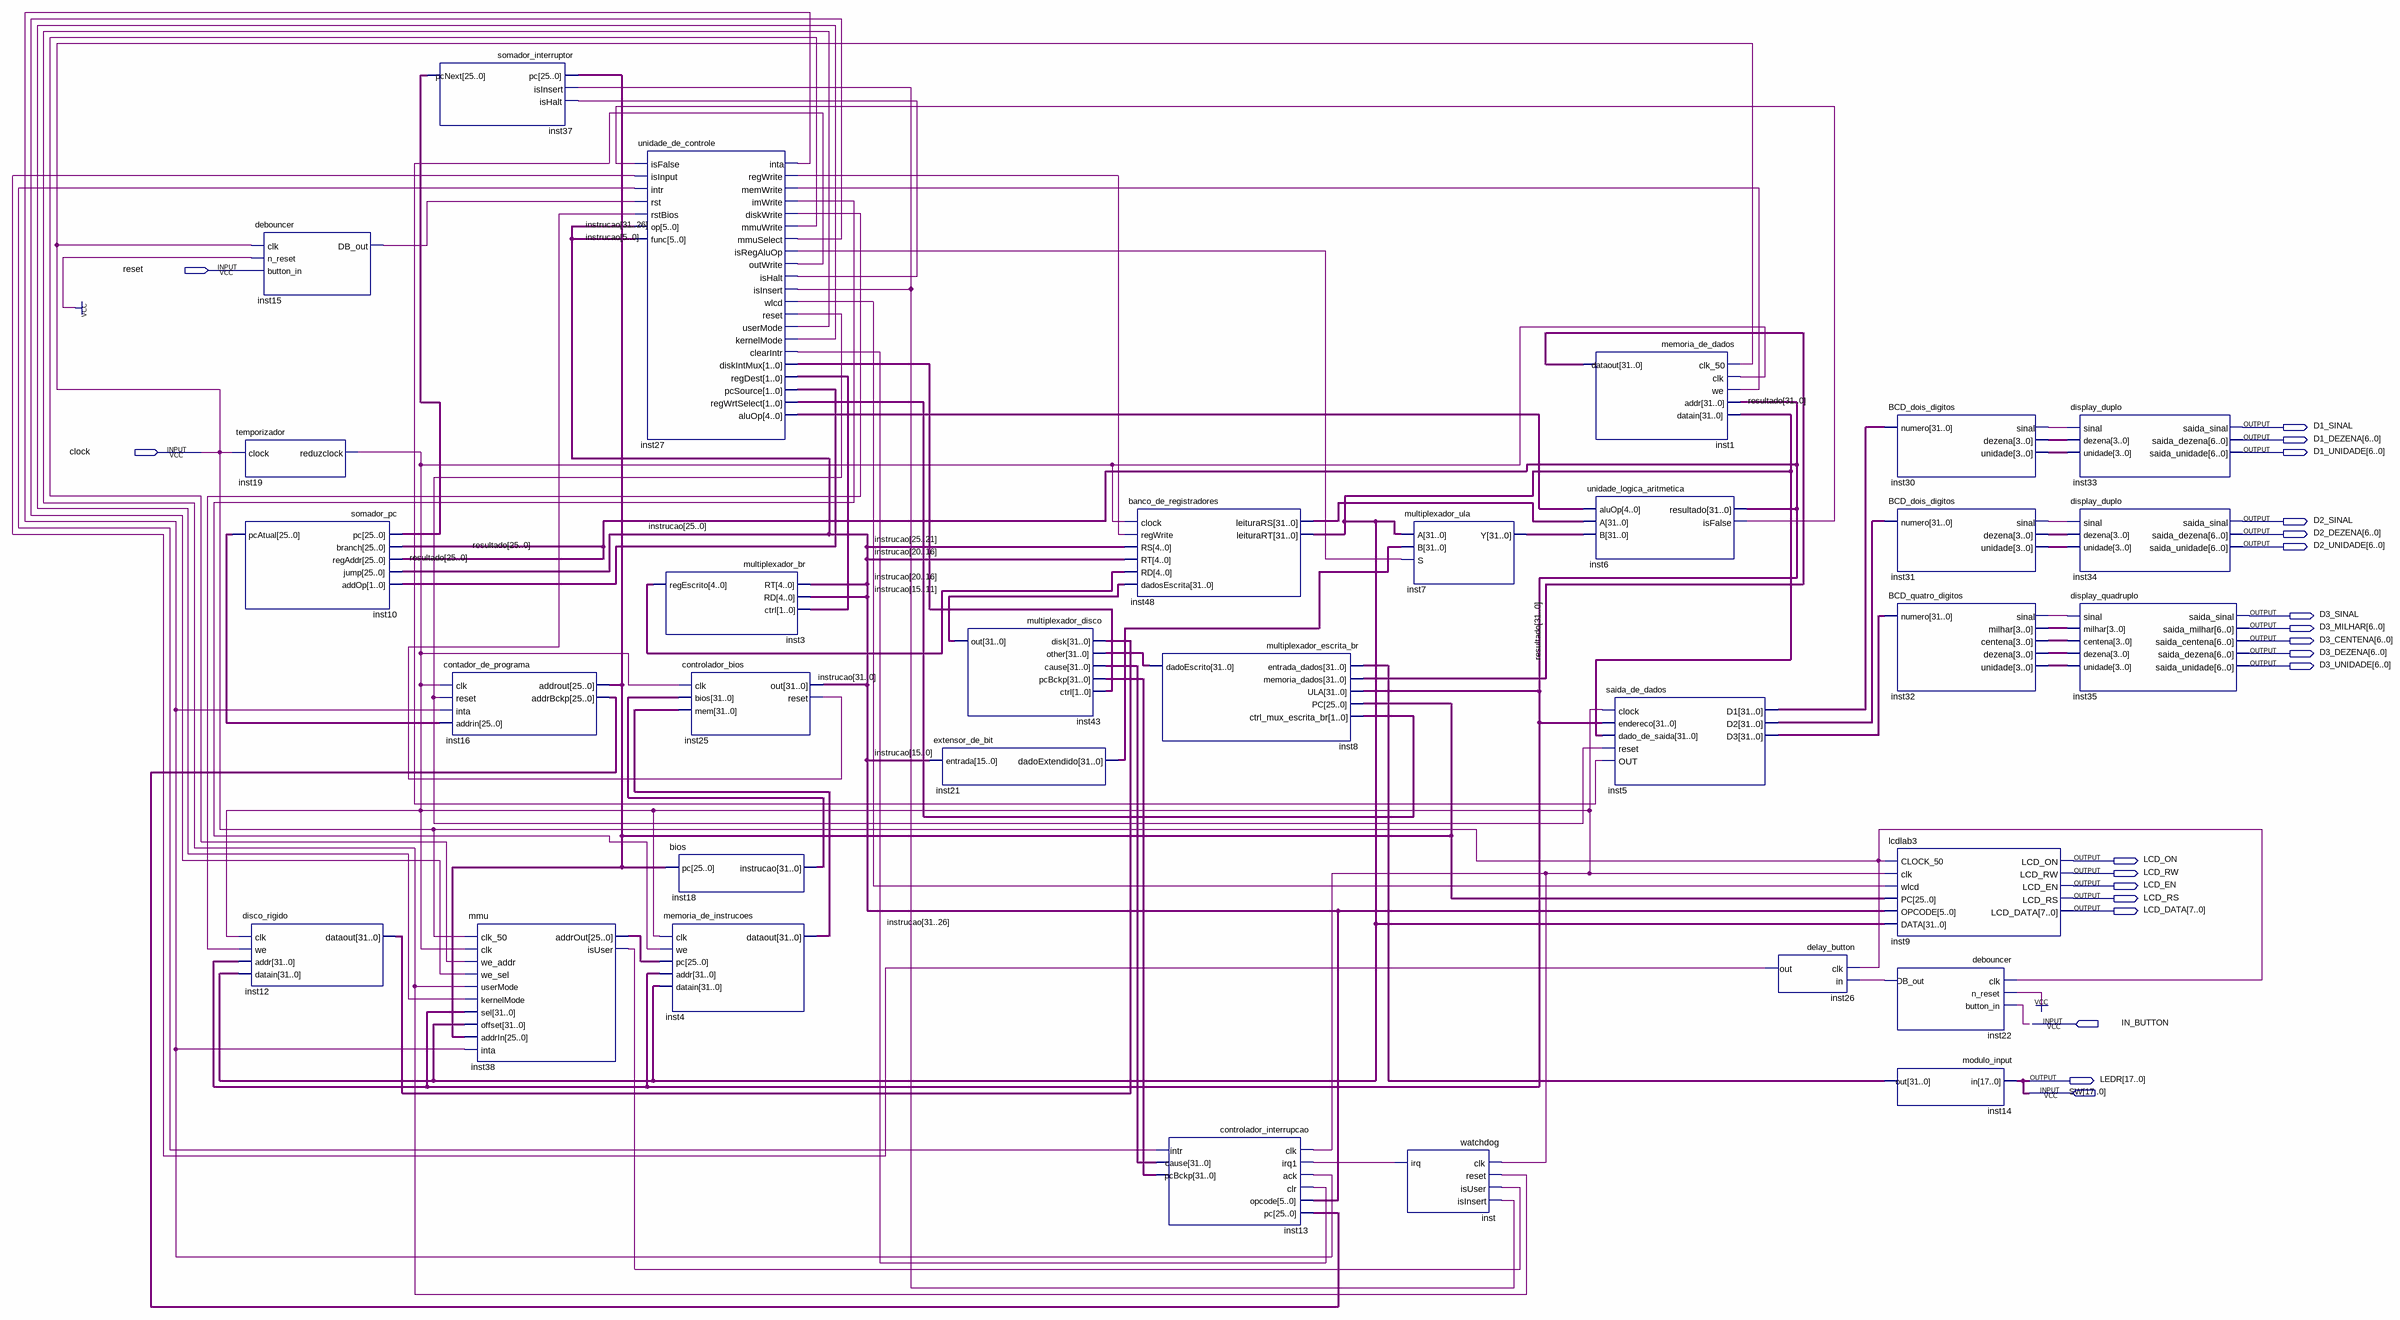
[diagram p0: schematic sheet]
// Quartus schematic iZero.bdf as structural Verilog: 32 symbols, 21 pins
module iZero (
  input  reset,
  input  clock,
  input  IN_BUTTON,
  input  [17:0] SW,
  output D1_SINAL,
  output [6:0] D1_DEZENA,
  output [6:0] D1_UNIDADE,
  output D2_SINAL,
  output [6:0] D2_DEZENA,
  output [6:0] D2_UNIDADE,
  output D3_SINAL,
  output [6:0] D3_MILHAR,
  output [6:0] D3_CENTENA,
  output [6:0] D3_DEZENA,
  output [6:0] D3_UNIDADE,
  output LCD_ON,
  output LCD_RW,
  output LCD_EN,
  output LCD_RS,
  output [7:0] LCD_DATA,
  output [17:0] LEDR
);

  wire inst6_isfalse, inst13_intr, inst15_db_out, inst19_reduzclock, inst22_db_out, inst25_reset, inst26_out,
       inst27_clearintr, inst27_diskwrite, inst27_imwrite, inst27_inta, inst27_ishalt, inst27_isinsert,
       inst27_isregaluop, inst27_kernelmode, inst27_memwrite, inst27_mmuselect, inst27_mmuwrite,
       inst27_outwrite, inst27_regwrite, inst27_reset, inst27_usermode, inst27_wlcd, inst30_sinal,
       inst31_sinal, inst32_sinal, inst38_isuser, inst_irq;
  wire [1:0] inst27_diskintmux, inst27_pcsource, inst27_regdest, inst27_regwrtselect;
  wire [3:0] inst30_dezena, inst30_unidade, inst31_dezena, inst31_unidade, inst32_centena, inst32_dezena,
       inst32_milhar, inst32_unidade;
  wire [4:0] inst3_regescrito, inst27_aluop;
  wire [25:0] inst10_pcatual, inst16_addrbckp, inst16_addrout, inst37_pcnext, inst38_addrout;
  wire [31:0] inst1_dataout, inst4_dataout, inst5_d1, inst5_d2, inst5_d3, inst7_y, inst8_dadoescrito,
       inst12_dataout, inst13_cause, inst13_pcbckp, inst14_out, inst18_instrucao, inst21_dadoextendido,
       inst43_out, inst48_leiturars, inst48_leiturart, instrucao, resultado;

  debouncer inst15 (.clk(clock), .n_reset(1'b1), .button_in(reset), .DB_out(inst15_db_out));
  temporizador inst19 (.clock(clock), .reduzclock(inst19_reduzclock));
  somador_pc inst10 (
    .pc(inst37_pcnext), .branch(resultado[25:0]), .regAddr(resultado[25:0]), .jump(instrucao[25:0]),
    .addOp(inst27_pcsource), .pcAtual(inst10_pcatual));
  disco_rigido inst12 (
    .clk(inst19_reduzclock), .we(inst27_diskwrite), .addr(resultado), .datain(inst48_leiturart),
    .dataout(inst12_dataout));
  somador_interruptor inst37 (
    .pc(inst16_addrout), .isInsert(inst27_isinsert), .isHalt(inst27_ishalt), .pcNext(inst37_pcnext));
  contador_de_programa inst16 (
    .clk(inst19_reduzclock), .reset(inst27_reset), .inta(inst27_inta), .addrin(inst10_pcatual),
    .addrout(inst16_addrout), .addrBckp(inst16_addrbckp));
  mmu inst38 (
    .clk_50(clock), .clk(inst19_reduzclock), .we_addr(inst27_mmuwrite), .we_sel(inst27_mmuselect),
    .userMode(inst27_usermode), .kernelMode(inst27_kernelmode), .sel(resultado), .offset(inst48_leiturart),
    .addrIn(inst16_addrout), .inta(inst27_inta), .addrOut(inst38_addrout), .isUser(inst38_isuser));
  unidade_de_controle inst27 (
    .isFalse(inst6_isfalse), .isInput(inst26_out), .intr(inst13_intr), .rst(inst15_db_out),
    .rstBios(inst25_reset), .op(instrucao[31:26]), .func(instrucao[5:0]), .inta(inst27_inta),
    .regWrite(inst27_regwrite), .memWrite(inst27_memwrite), .imWrite(inst27_imwrite),
    .diskWrite(inst27_diskwrite), .mmuWrite(inst27_mmuwrite), .mmuSelect(inst27_mmuselect),
    .isRegAluOp(inst27_isregaluop), .outWrite(inst27_outwrite), .isHalt(inst27_ishalt),
    .isInsert(inst27_isinsert), .wlcd(inst27_wlcd), .reset(inst27_reset), .userMode(inst27_usermode),
    .kernelMode(inst27_kernelmode), .clearIntr(inst27_clearintr), .diskIntMux(inst27_diskintmux),
    .regDest(inst27_regdest), .pcSource(inst27_pcsource), .regWrtSelect(inst27_regwrtselect),
    .aluOp(inst27_aluop));
  multiplexador_br inst3 (
    .RT(instrucao[20:16]), .RD(instrucao[15:11]), .ctrl(inst27_regdest), .regEscrito(inst3_regescrito));
  controlador_bios inst25 (
    .clk(inst19_reduzclock), .bios(inst18_instrucao), .mem(inst4_dataout), .out(instrucao),
    .reset(inst25_reset));
  bios inst18 (.pc(inst16_addrout), .instrucao(inst18_instrucao));
  memoria_de_instrucoes inst4 (
    .clk(inst19_reduzclock), .we(inst27_imwrite), .pc(inst38_addrout), .addr(resultado),
    .datain(inst48_leiturart), .dataout(inst4_dataout));
  extensor_de_bit inst21 (.entrada(instrucao[15:0]), .dadoExtendido(inst21_dadoextendido));
  multiplexador_disco inst43 (
    .disk(inst12_dataout), .other(inst8_dadoescrito), .cause(inst13_cause), .pcBckp(inst13_pcbckp),
    .ctrl(inst27_diskintmux), .out(inst43_out));
  banco_de_registradores inst48 (
    .clock(inst19_reduzclock), .regWrite(inst27_regwrite), .RS(instrucao[25:21]), .RT(instrucao[20:16]),
    .RD(inst3_regescrito), .dadosEscrita(inst43_out), .leituraRS(inst48_leiturars),
    .leituraRT(inst48_leiturart));
  multiplexador_escrita_br inst8 (
    .entrada_dados(inst14_out), .memoria_dados(inst1_dataout), .ULA(resultado), .PC(inst16_addrout),
    .ctrl_mux_escrita_br(inst27_regwrtselect), .dadoEscrito(inst8_dadoescrito));
  controlador_interrupcao inst13 (
    .clk(inst19_reduzclock), .irq1(inst_irq), .ack(inst27_inta), .clr(inst27_clearintr),
    .opcode(instrucao[31:26]), .pc(inst16_addrbckp), .intr(inst13_intr), .cause(inst13_cause),
    .pcBckp(inst13_pcbckp));
  multiplexador_ula inst7 (.A(inst48_leiturart), .B(inst21_dadoextendido), .S(inst27_isregaluop), .Y(inst7_y));
  watchdog inst (
    .clk(inst19_reduzclock), .reset(inst27_usermode), .isUser(inst38_isuser), .isInsert(inst27_isinsert),
    .irq(inst_irq));
  memoria_de_dados inst1 (
    .clk_50(clock), .clk(inst19_reduzclock), .we(inst27_memwrite), .addr(resultado),
    .datain(inst48_leiturart), .dataout(inst1_dataout));
  unidade_logica_aritmetica inst6 (
    .aluOp(inst27_aluop), .A(inst48_leiturars), .B(inst7_y), .resultado(resultado), .isFalse(inst6_isfalse));
  saida_de_dados inst5 (
    .clock(inst19_reduzclock), .endereco(resultado), .dado_de_saida(inst48_leiturart), .reset(inst27_reset),
    .OUT(inst27_outwrite), .D1(inst5_d1), .D2(inst5_d2), .D3(inst5_d3));
  delay_button inst26 (.clk(clock), .in(inst22_db_out), .out(inst26_out));
  BCD_dois_digitos inst30 (.numero(inst5_d1), .sinal(inst30_sinal), .dezena(inst30_dezena), .unidade(inst30_unidade));
  BCD_dois_digitos inst31 (.numero(inst5_d2), .sinal(inst31_sinal), .dezena(inst31_dezena), .unidade(inst31_unidade));
  BCD_quatro_digitos inst32 (
    .numero(inst5_d3), .sinal(inst32_sinal), .milhar(inst32_milhar), .centena(inst32_centena),
    .dezena(inst32_dezena), .unidade(inst32_unidade));
  lcdlab3 inst9 (
    .CLOCK_50(clock), .clk(inst19_reduzclock), .wlcd(inst27_wlcd), .PC(inst16_addrout),
    .OPCODE(instrucao[31:26]), .DATA(inst48_leiturart), .LCD_ON(LCD_ON), .LCD_RW(LCD_RW), .LCD_EN(LCD_EN),
    .LCD_RS(LCD_RS), .LCD_DATA(LCD_DATA));
  debouncer inst22 (.clk(clock), .n_reset(1'b1), .button_in(IN_BUTTON), .DB_out(inst22_db_out));
  modulo_input inst14 (.in(SW), .out(inst14_out));
  display_duplo inst33 (
    .sinal(inst30_sinal), .dezena(inst30_dezena), .unidade(inst30_unidade), .saida_sinal(D1_SINAL),
    .saida_dezena(D1_DEZENA), .saida_unidade(D1_UNIDADE));
  display_duplo inst34 (
    .sinal(inst31_sinal), .dezena(inst31_dezena), .unidade(inst31_unidade), .saida_sinal(D2_SINAL),
    .saida_dezena(D2_DEZENA), .saida_unidade(D2_UNIDADE));
  display_quadruplo inst35 (
    .sinal(inst32_sinal), .milhar(inst32_milhar), .centena(inst32_centena), .dezena(inst32_dezena),
    .unidade(inst32_unidade), .saida_sinal(D3_SINAL), .saida_milhar(D3_MILHAR), .saida_centena(D3_CENTENA),
    .saida_dezena(D3_DEZENA), .saida_unidade(D3_UNIDADE));

  assign LEDR = SW;
endmodule
